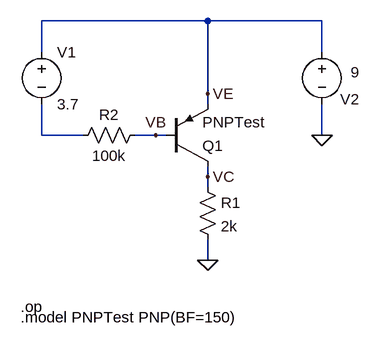
[diagram p0: schematic 3_12_tp3_ej3_2_pablo_gomez.asc]
3_12_tp3_ej3_2_pablo_gomez.asc, the LTspice schematic file:
Version 4
SHEET 1 880 680
WIRE 224 -80 -32 -80
WIRE 400 -80 224 -80
WIRE -32 -32 -32 -80
WIRE 400 -32 400 -80
WIRE 224 32 224 -80
WIRE 224 48 224 32
WIRE -32 96 -32 48
WIRE 32 96 -32 96
WIRE 144 96 112 96
WIRE 160 96 144 96
WIRE 400 96 400 48
WIRE 224 160 224 144
WIRE 224 176 224 160
WIRE 224 288 224 256
FLAG 144 96 VB
FLAG 224 32 VE
FLAG 224 288 0
FLAG 400 96 0
FLAG 224 160 VC
SYMBOL res 208 160 R0
SYMATTR InstName R1
SYMATTR Value 2k
SYMBOL res 128 80 R90
WINDOW 0 0 56 VBottom 2
WINDOW 3 32 56 VTop 2
SYMATTR InstName R2
SYMATTR Value 100k
SYMBOL voltage -32 -48 R0
WINDOW 123 0 0 Left 0
WINDOW 39 0 0 Left 0
SYMATTR InstName V1
SYMATTR Value 3.7
SYMBOL voltage 400 -48 R0
WINDOW 0 28 89 Left 2
WINDOW 3 44 47 Left 2
WINDOW 123 0 0 Left 0
WINDOW 39 0 0 Left 0
SYMATTR InstName V2
SYMATTR Value 9
SYMBOL pnp 160 144 M180
SYMATTR InstName Q1
SYMATTR Value PNPTest
TEXT -64 376 Left 2 !.model PNPTest PNP(BF=150)
TEXT -64 360 Left 2 !.op

The netlist it stands for:
* 3_12_tp3_ej3_2_pablo_gomez.asc
R1 VC 0 2k
R2 VB N001 100k
V1 VE N001 3.7
V2 VE 0 9
Q1 VC VB VE 0 PNPTest
.model NPN NPN
.model PNP PNP
.lib standard.bjt
.model PNPTest PNP(BF=150)
.op
.backanno
.end